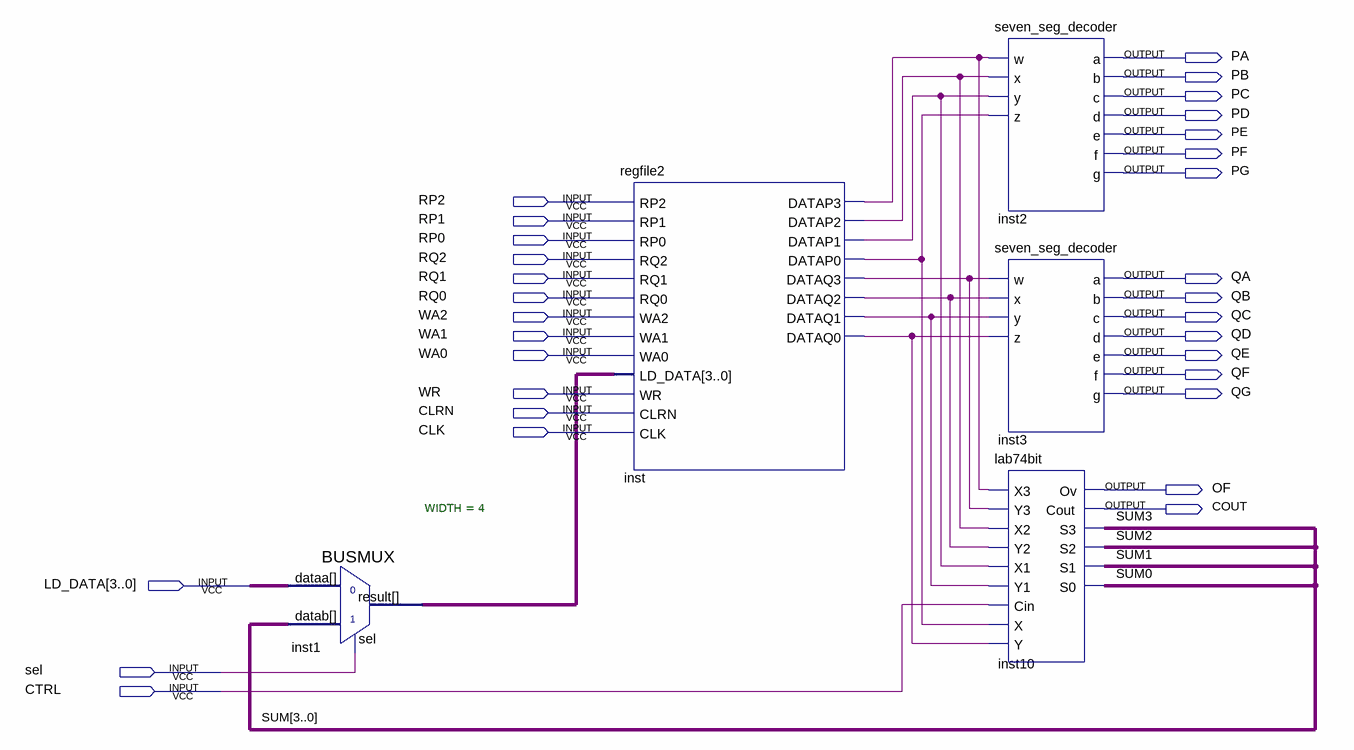
[diagram p0: schematic sheet]
// Quartus schematic lab12step5.bdf as structural Verilog: 5 symbols, 31 pins
module lab12step5 (
  input  RP2,
  input  RP1,
  input  RP0,
  input  RQ2,
  input  RQ1,
  input  RQ0,
  input  WA2,
  input  WA1,
  input  WA0,
  input  WR,
  input  CLRN,
  input  CLK,
  input  [3:0] LD_DATA,
  input  sel,
  input  CTRL,
  output PA,
  output PB,
  output PC,
  output PD,
  output PE,
  output PF,
  output PG,
  output QA,
  output QB,
  output QC,
  output QD,
  output QE,
  output QF,
  output QG,
  output OF,
  output COUT
);

  wire inst_datap0, inst_datap1, inst_datap2, inst_datap3, inst_dataq0, inst_dataq1, inst_dataq2, inst_dataq3;
  wire [3:0] inst1_result, SUM;

  BUSMUX #(.WIDTH(4)) inst1 (.datab(SUM), .sel(sel), .dataa(LD_DATA), .result(inst1_result));
  regfile2 inst (
    .RP2(RP2), .RP1(RP1), .RP0(RP0), .RQ2(RQ2), .RQ1(RQ1), .RQ0(RQ0), .WA2(WA2), .WA1(WA1), .WA0(WA0),
    .LD_DATA(inst1_result), .WR(WR), .CLRN(CLRN), .CLK(CLK), .DATAP3(inst_datap3), .DATAP2(inst_datap2),
    .DATAP1(inst_datap1), .DATAP0(inst_datap0), .DATAQ3(inst_dataq3), .DATAQ2(inst_dataq2),
    .DATAQ1(inst_dataq1), .DATAQ0(inst_dataq0));
  seven_seg_decoder inst2 (
    .w(inst_datap3), .x(inst_datap2), .y(inst_datap1), .z(inst_datap0), .a(PA), .b(PB), .c(PC), .d(PD),
    .e(PE), .f(PF), .g(PG));
  seven_seg_decoder inst3 (
    .w(inst_dataq3), .x(inst_dataq2), .y(inst_dataq1), .z(inst_dataq0), .a(QA), .b(QB), .c(QC), .d(QD),
    .e(QE), .f(QF), .g(QG));
  lab74bit inst10 (
    .X3(inst_datap3), .Y3(inst_dataq3), .X2(inst_datap2), .Y2(inst_dataq2), .X1(inst_datap1),
    .Y1(inst_dataq1), .Cin(CTRL), .X(inst_datap0), .Y(inst_dataq0), .Ov(OF), .Cout(COUT), .S3(SUM[3]),
    .S2(SUM[2]), .S1(SUM[1]), .S0(SUM[0]));
endmodule
